# Altium schematic sheet I2C.SchDoc
size A4
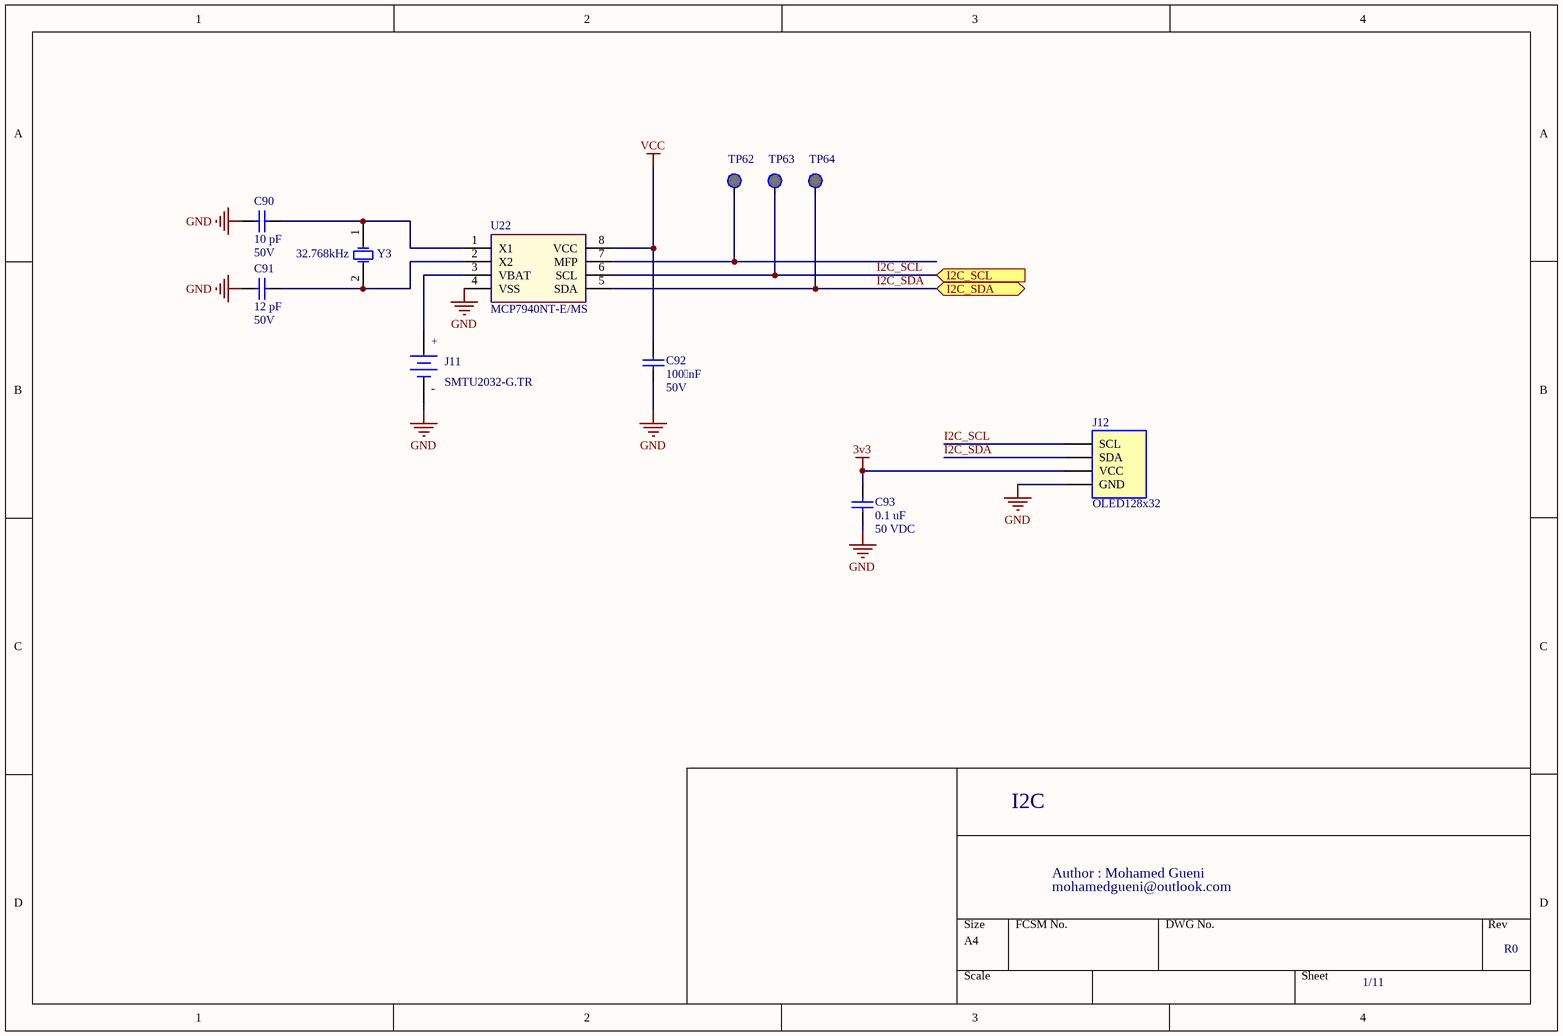
[diagram p0: I2C.SchDoc]

## Parts
C90  Value 1: 10 pF  Value 2: 50V  [CAPC1608N]
C91  Value 1: 12 pF  Value 2: 50V  [CAPC1608N]
C92  Value 1: 100 nF  Value 2: 50V  [CAPC1608N]  (hidden comment: GRM188R71H104KA93D)
C93  Value 1: 0.1 uF  Value 2: 50 VDC  [CAPC1608N]  (hidden comment: Capacitor)
J11  SMTU2032-G.TR  [SMTU2032GTR]
J12  OLED128x32  [OLED128x32]
TP62  Test Point  [TP]  (value not drawn)  (no BOM)
TP63  Test Point  [TP]  (value not drawn)  (no BOM)
TP64  Test Point  [TP]  (value not drawn)  (no BOM)
U22  MCP7940NT-E/MS  [SOP65P490X110-8N]
Y3  Value 1: 32.768kHz  [XT1312HHRXX32K76E]  (hidden comment: XT1312HHRXX32K76E)

## Ports
I2C_SCL (in), I2C_SDA (bidir)

## Nets
3v3: C93.2 J12.2(VCC)
GND: C90.1 C91.1 C92.1 C93.1 J11.2(-) J12.1(GND) U22.4(VSS)
VCC: C92.2 U22.8(VCC)
I2C_SCL: J12.4(SCL) TP63.1 U22.6(SCL) ; port I2C_SCL
I2C_SDA: J12.3(SDA) TP64.1 U22.5(SDA) ; port I2C_SDA
NetC90_2: C90.2 U22.1(X1) Y3.1(OSC1)
NetC91_2: C91.2 U22.2(X2) Y3.2(OSC2)
NetJ11_1: J11.1(+) U22.3(VBAT)
NetTP62_1: TP62.1 U22.7(MFP)

## Notes on the sheet
- I2C
- Author : Mohamed Gueni
- mohamedgueni@outlook.com
- 1/11
- R0

## Library data of the parts
C90 = CAP-000000033: FTP: 603; Part Number: CAP-000000033
C91 = CAP-000000032: FTP: 603; Part Number: CAP-000000032
C92 = CAP-000000017: MAN: Murata; DES: Ceramic Capacitor, 100 nF, 50V, X7R, 0603; FTP: 603; SUPREF: 81-GRM188R71H104KA93D; Part Number: CAP-000000017; MANREF: GRM188R71H104KA93D
C93 = CAP-000000003: MAN: KEMET; MANREF: C0603C104M5RAC; DES: Multilayer Ceramic Capacitors MLCC - SMD/SMT 50V 0.1uF 0603 X7R 20%; TOL: 20 %; FTP: 0603; SUP: Mouser; SUPREF: 80-C0603C104M5RAC; NOTE: _; Part Number: CAP-000000003
J11 = CON-000000012: MAN: Renata; DES: Coin Cell Battery Holders SMT HLDR-T&R-GLD CON FOR CR2032MFR; Value 1: _; FTP: SMT; SUP: Mouser; SUPREF: 614-SMTU2032-G.TR; Part Number: CON-000000012; MANREF: SMTU2032-G.TR; Value 2: _; TOL: _; NOTE: _
J12 = CON-000000009: TOL: _; FTP: THT; SUP: Mouser; MAN: Samtec; MANREF: CES-104-02-S-S; SUPREF: 200-CES10402SS; Part Number: CON-000000009; NOTE: _
TP62-TP64 = MIS-000000002: MAN: _; Part Number: MIS-000000002; MANREF: _; DES: _; Value 1: _; Value 2: _; TOL: _; FTP: _; SUP: _; SUPREF: _; NOTE: _
U22 = GIC-000000014: Real Time Clock I2C GP RTCC 64B SRAM, EXT; MAN: Microchip Technology; TOL: _; FTP: MSOP-8; SUP: Mouser; SUPREF: 579-MCP7940NT-E/MS; Part Number: GIC-000000014; MANREF: MCP7940NT-E/MS; DES: Real Time Clock I2C GP RTCC 64B SRAM, EXT; NOTE: _
Y3 = Y-000000006: MAN: Vishay; DES: Crystals Xtal 3.2X1.5, 12.5pF, 32.768kHz; Value 2: 12pF; TOL: 30 PPM; SUP: Mouser; SUPREF: 70-XT1312HHRXX32K76E; NOTE: _; Part Number: Y-000000006; MANREF: XT1312HHRXX32K76E